# EAGLE design Moist_Led (EAGLE 7.7.0)
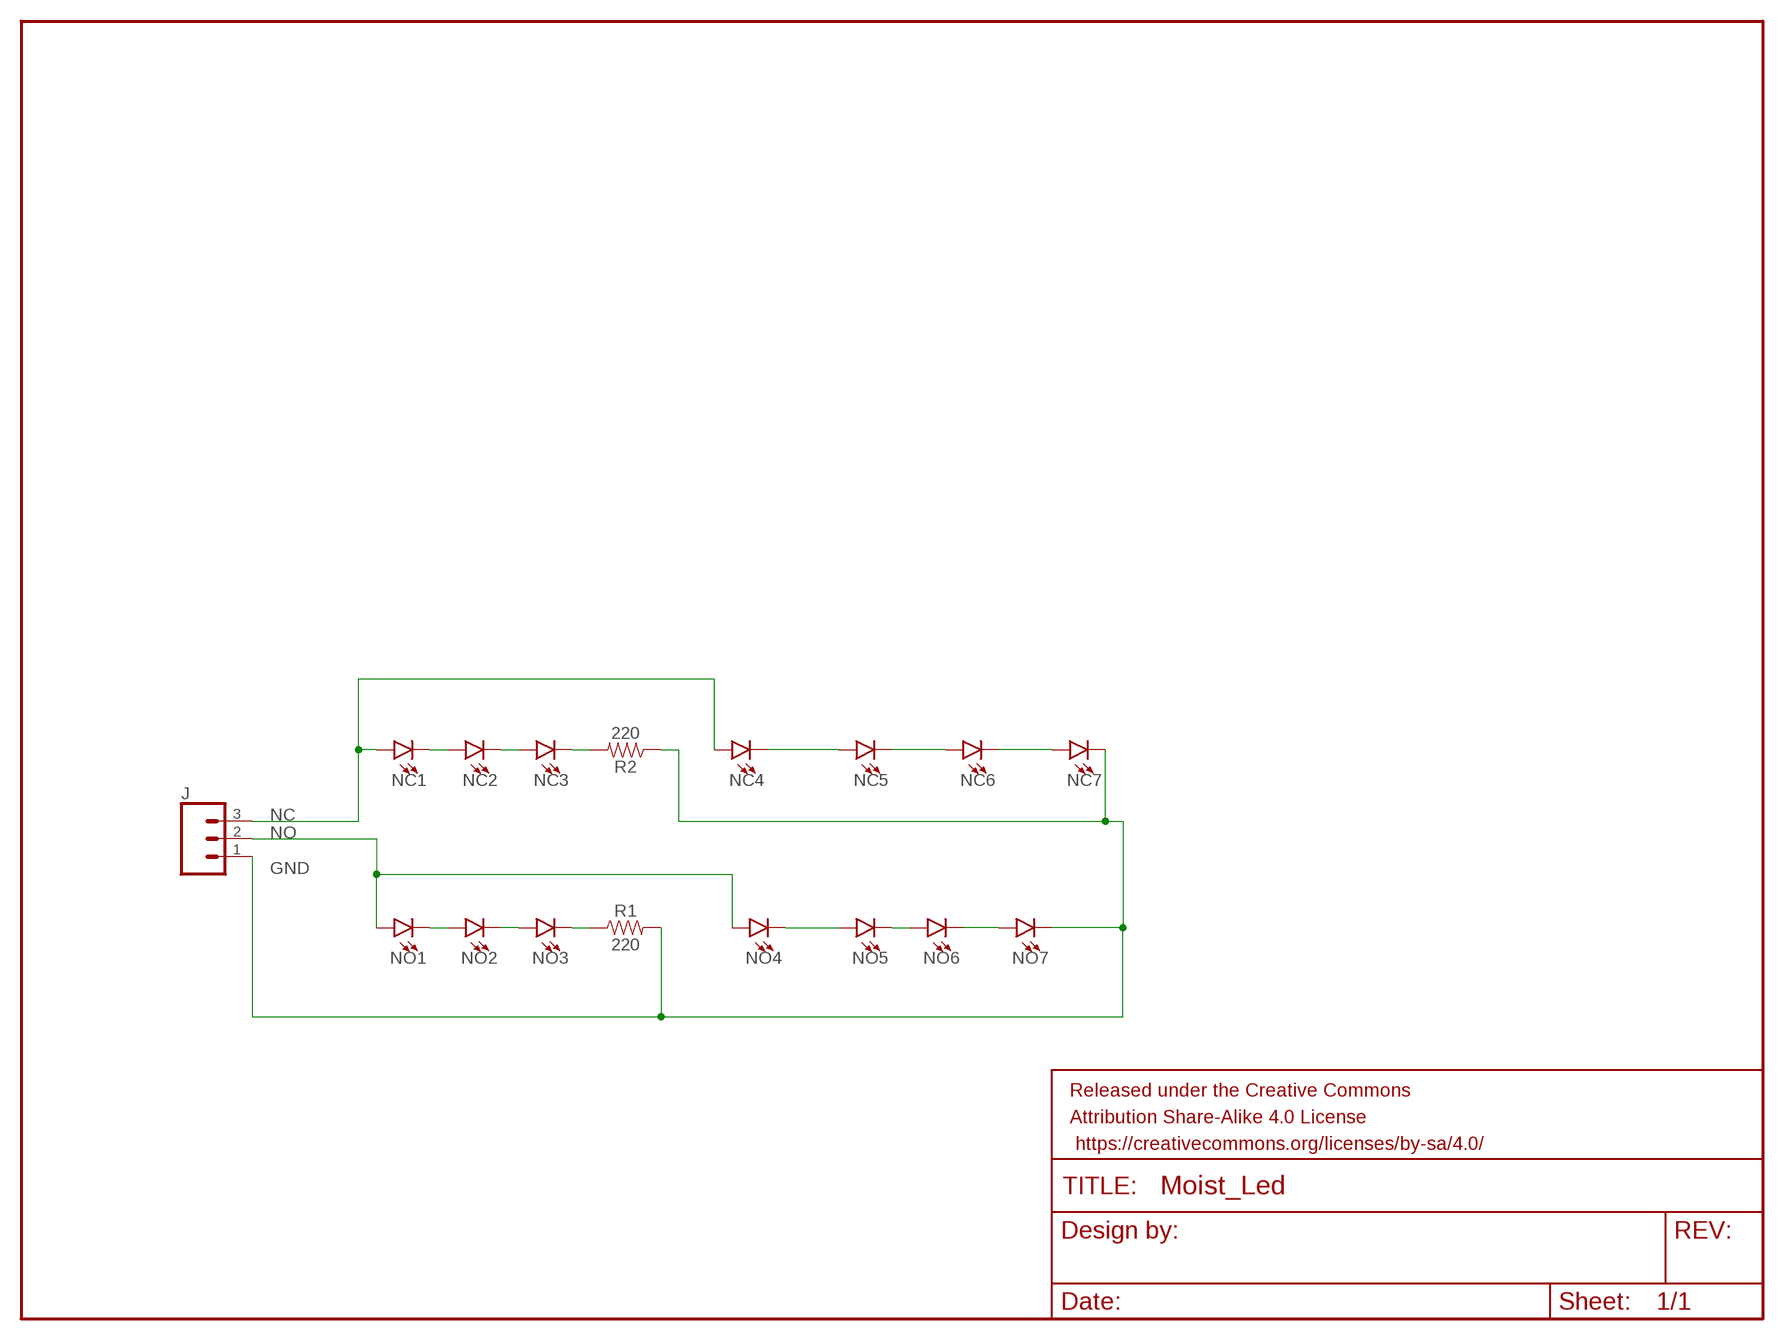
[diagram p0: schematic, sheet 1]

## Parts
FRAME1  FRAME-LETTER  [CREATIVE_COMMONS]
J  CONN_03  [1X03]
NC1  LED5MM  [LED_5MM]
NC2  LED5MM  [LED_5MM]
NC3  LED5MM  [LED_5MM]
NC4  LED5MM  [LED_5MM]
NC5  LED5MM  [LED_5MM]
NC6  LED5MM  [LED_5MM]
NC7  LED5MM  [LED_5MM]
NO1  LED5MM  [LED_5MM]
NO2  LED5MM  [LED_5MM]
NO3  LED5MM  [LED_5MM]
NO4  LED5MM  [LED_5MM]
NO5  LED5MM  [LED_5MM]
NO6  LED5MM  [LED_5MM]
NO7  LED5MM  [LED_5MM]
R1  220  10OHM-HORIZ-1/4W-1%  [AXIAL-0.3]
R2  220  10OHM-HORIZ-1/4W-1%  [AXIAL-0.3]

## Nets
GND: J.1 NC7.K(C) NO7.K(C) R1.P$2 R2.P$1
N$1: NO1.K(C) NO2.A
N$2: NO2.K(C) NO3.A
N$3: NC1.K(C) NC2.A
N$4: NC2.K(C) NC3.A
N$5: NC3.K(C) R2.P$2
N$6: NC5.K(C) NC6.A
N$7: NC6.K(C) NC7.A
N$8: NO6.K(C) NO7.A
N$9: NO5.K(C) NO6.A
N$10: NO4.K(C) NO5.A
N$11: NO3.K(C) R1.P$1
NC: J.3 NC1.A NC4.A
NC4: NC4.K(C) NC5.A
NO: J.2 NO1.A NO4.A

## Library data of the parts
FRAME1 = SparkFun-Aesthetics:FRAME-LETTER: Schematic Frame - Letter Standard 8.5x11 US Letter frame
J = SparkFun-Connectors:CONN_03: Multi connection point. Often used as Generic Header-pin footprint for 0.1 inch spaced/style header connections On any of the 0.1 inch spaced packages, you can populate with these: Break Away Headers - Straight <https://www.sparkfun.com/products/116> (PRT-00116) Break Away Male Headers - Right Angle <https://www.sparkfun.com/products/553> (PRT-00553) Female Headers <https://www.sparkfun.com/products/115> (PRT-00115) Break Away Headers - Machine Pin <https://www.sparkfun.com/products/117> (PRT-00117) Break Away Female Headers - Swiss Machine Pin <https://www.sparkfun.com/products/743> (PRT-00743) Stackable Header - 3 Pin (Female, 0.1") <https://www.sparkfun.com/products/13875> (PRT-13875) For SCREWTERMINALS and SPRING TERMINALS visit here: Screw Terimnals on SparkFun.com <https://www.sparkfun.com/search/results?term=Screw+Terminals> (5mm/3.5mm/2.54mm spacing) This device is also useful as a general connection point to wire up your design to another part of your project. Our various solder wires solder well into these plated through hole pads. Hook-Up Wire - Assortment (Stranded, 22 AWG) <https://www.sparkfun.com/products/11375> (PRT-11375) Hook-Up Wire - Assortment (Solid Core, 22 AWG) <https://www.sparkfun.com/products/11367> (PRT-11367) View the entire wire category on our website here <https://www.sparkfun.com/categories/141> Special notes: Molex polarized connector foot print use with SKU : PRT-08232 with associated crimp pins and housings.
NC1-NC7 NO1-NO7 = SparkFun-LED:LED: LED (Generic) Standard schematic elements and footprints for 5mm, 3mm, 1206, and 0603 sized LEDs. Generic LEDs with no color specified.
R1 R2 = SparkFun-Resistors:10OHM: 10Ω resistor A resistor is a passive two-terminal electrical component that implements electrical resistance as a circuit element. Resistors act to reduce current flow, and, at the same time, act to lower voltage levels within circuits. - Wikipedia; PROD_ID: RES-12180; VALUE: 10

## Board
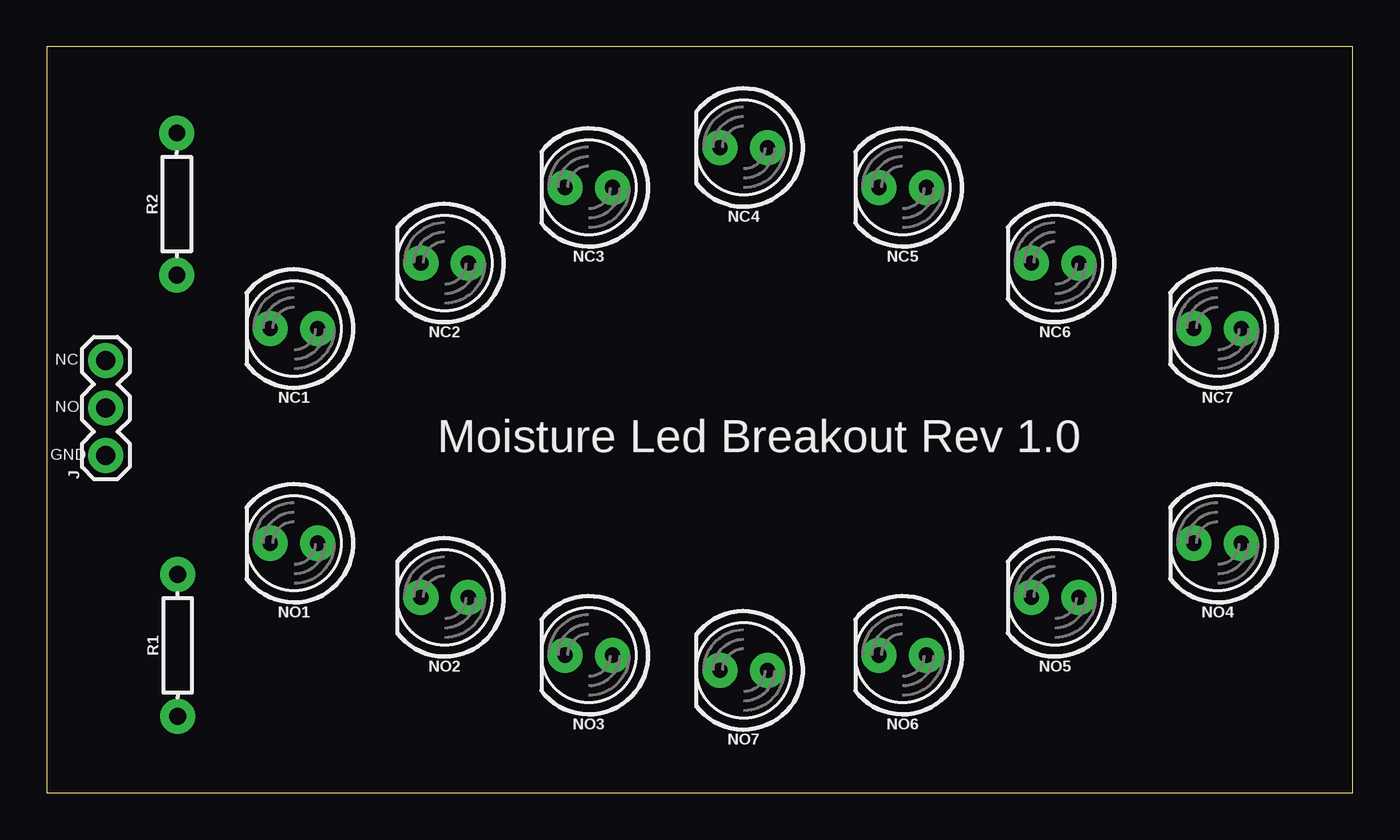
[diagram p1: board, top side]
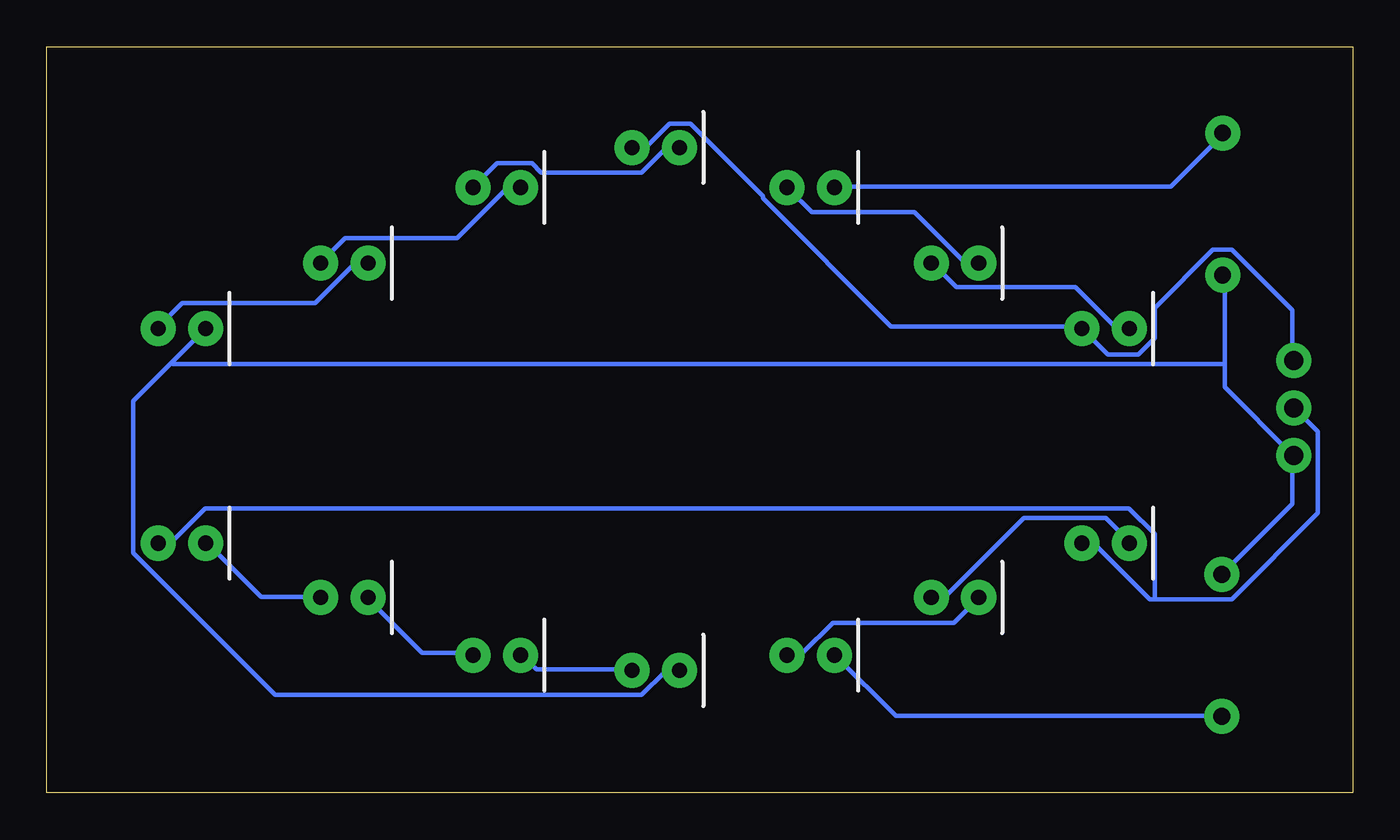
[diagram p2: board, bottom side, seen from below]

Size 70 x 40 mm. Coordinates in mm from the lower left corner, seen from the top.
Outline: 0,0 70,0 70,40 0,40 0,0
Copper layers (1*16): Top 0.035mm / dielectric 1.5mm / Bottom 0.035mm
Design rules "default": minimum track width 10mil, minimum drill 24mil, track to track 8mil, track to pad 8mil, pad to pad 8mil, via to via 8mil, smd to smd 8mil, copper to edge 40mil, drill to drill 8mil, minimum pad ring 10mil, minimum via ring 8mil, stop-mask expansion 4mil, vias tented up to drill 0mil, thermal gap 10mil

### Footprints (pad centres in the part's own frame; a part is rotated, then mirrored left to right if it is on the bottom)
1X03 = drill 1.016 pad 1.88: 1 0,0; 2 2.54,0; 3 5.08,0
LED_5MM = drill 0.813 pad 1.88: A -1.27,0; K 1.27,0
AXIAL-0.3 = drill 0.9 pad 1.88: P$1 -3.81,0; P$2 3.81,0

### Placement (x,y rotation side)
FRAME1  -101.6,1.27 0 top  (outside the outline)
J  3.17,18.09 90 top
NC1  13.25,24.89 180 top
NC2  21.33,28.4 180 top
NC3  29.05,32.45 180 top
NC4  37.35,34.59 180 top
NC5  45.87,32.45 180 top
NC6  54.04,28.4 180 top
NC7  62.75,24.89 180 top
NO1  13.25,13.38 180 top
NO2  21.33,10.48 180 top
NO3  29.05,7.38 180 top
NO4  62.75,13.38 180 top
NO5  54.04,10.48 180 top
NO6  45.87,7.38 180 top
NO7  37.35,6.57 180 top
R1  7.02,7.91 90 top
R2  6.98,31.56 90 top

### Tracks (layer width: path | path; a pad name or v marks a point on that pad's centre or on a via)
GND
  Bottom 0.254: R1.P$2 7,11.75 3.25,15.5 3.25,18 J.1 3.25,18.12 6.88,21.75 6.88,23 | 6.88,23 6.88,27.75 R2.P$1 | 63.31,23.06 61.5,24.88 NC7.K | 63.31,23.06 65.38,21 65.38,12.88 57.75,5.25 38.12,5.25 36.88,6.5 36.12,6.5 NO7.K | 6.88,23 63.25,23 63.31,23.06
N$1
  Bottom 0.254: NO2.A 22.5,10.5 21.88,10.5 17.62,14.75 13.25,14.75 12,13.5 NO1.K
N$2
  Bottom 0.254: NO3.A 30.25,7.5 29.5,7.5 27.88,9.12 21.38,9.12 20.12,10.38 NO2.K
N$3
  Bottom 0.254: NC1.K 12,25 12.75,25 14.88,27.12 21.25,27.12 22.5,28.38 NC2.A
N$4
  Bottom 0.254: NC2.K 20.12,28.5 20.88,28.5 23.5,31.12 29,31.12 30.25,32.38 NC3.A
N$5
  Bottom 0.254: NC3.K 27.75,32.5 9.75,32.5 7,35.25 R2.P$2
N$6
  Bottom 0.254: NC5.K 44.62,32.38 45.38,32.38 48,29.75 54,29.75 55.25,28.5 NC6.A
N$7
  Bottom 0.254: NC6.K 52.88,28.38 53.5,28.38 55.62,26.25 62.75,26.25 64,25 NC7.A
N$8
  Bottom 0.254: NO7.A 38.62,6.62 43.75,6.62 44.5,7.38 NO6.K
N$9
  Bottom 0.254: NO6.A 47.25,7.5 49.88,7.5 52.75,10.38 NO5.K
N$10
  Bottom 0.254: NO5.A 55.38,10.5 58.5,10.5 61.38,13.38 NO4.K
N$11
  Bottom 0.254: R1.P$1 7.12,4.12 24.5,4.12 27.75,7.38 NO3.K
NC
  Bottom 0.254: J.3 3.25,23.25 3.25,25.88 6.5,29.12 7.5,29.12 10.62,26 10.62,24.38 11.5,23.5 13.12,23.5 14.5,24.88 NC1.A 14.62,25 24.75,25 31.62,31.88 31.62,32 35.5,35.88 36.62,35.88 37.88,34.62 38.5,34.62 NC4.A
NC4
  Bottom 0.254: NC4.K 36.12,34.5 36.88,34.5 38.12,33.25 43.5,33.25 44,33.75 45.88,33.75 47.12,32.5 NC5.A
NO
  Bottom 0.254: 10.62,10.38 6.5,10.38 1.88,15 1.88,19.38 3.12,20.62 J.2 | 10.62,10.38 10.88,10.38 13.88,13.38 14.5,13.38 NO1.A | 10.62,10.38 10.62,13.88 12,15.25 61.5,15.25 63.25,13.5 64,13.5 NO4.A
(copper drawn outside any net)
  shapes: Bottom area x1

### Text on the board
tPlace: Moisture Led Breakout Rev 1.0
tNames: NC | NO | GND